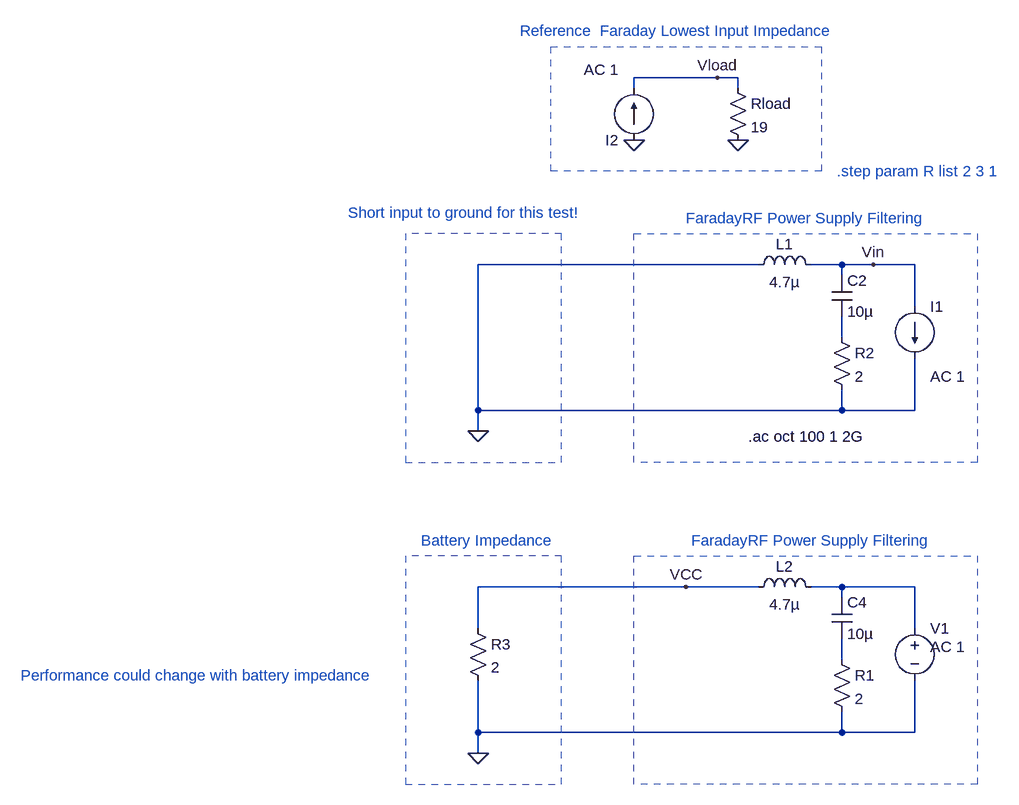
[diagram p0: schematic USBFiltering.asc]
USBFiltering.asc, the LTspice schematic file:
Version 4
SHEET 1 880 996
WIRE -32 -96 -160 -96
WIRE 0 -96 -32 -96
WIRE -160 -80 -160 -96
WIRE 0 -80 0 -96
WIRE 32 192 -400 192
WIRE 160 192 112 192
WIRE 208 192 160 192
WIRE 272 192 208 192
WIRE 160 208 160 192
WIRE 272 256 272 192
WIRE 160 304 160 272
WIRE -400 416 -400 192
WIRE 160 416 160 384
WIRE 160 416 -400 416
WIRE 272 416 272 336
WIRE 272 416 160 416
WIRE -400 448 -400 416
WIRE -80 688 -400 688
WIRE 32 688 -80 688
WIRE 160 688 112 688
WIRE 272 688 160 688
WIRE 160 704 160 688
WIRE -400 752 -400 688
WIRE 272 752 272 688
WIRE 160 800 160 768
WIRE -400 912 -400 832
WIRE 160 912 160 880
WIRE 160 912 -400 912
WIRE 272 912 272 832
WIRE 272 912 160 912
WIRE -400 944 -400 912
FLAG -400 448 0
FLAG -160 0 0
FLAG 0 0 0
FLAG -400 944 0
FLAG 208 192 Vin
FLAG -32 -96 Vload
FLAG -80 688 VCC
SYMBOL cap 144 208 R0
SYMATTR InstName C2
SYMATTR Value 10µ
SYMATTR SpiceLine Rser=10m
SYMBOL ind 16 208 R270
WINDOW 0 32 56 VTop 2
WINDOW 3 5 56 VBottom 2
SYMATTR InstName L1
SYMATTR Value 4.7µ
SYMATTR SpiceLine Ipk=1.9 Rser=0.1075 Rpar=442.74 Cpar=0 mfg="Coilcraft" pn="LPS4018-472"
SYMBOL res 144 288 R0
SYMATTR InstName R2
SYMATTR Value 2
SYMBOL res -16 -96 R0
SYMATTR InstName Rload
SYMATTR Value 19
SYMBOL cap 144 704 R0
SYMATTR InstName C4
SYMATTR Value 10µ
SYMATTR SpiceLine Rser=10m
SYMBOL ind 16 704 R270
WINDOW 0 32 56 VTop 2
WINDOW 3 5 56 VBottom 2
SYMATTR InstName L2
SYMATTR Value 4.7µ
SYMATTR SpiceLine Ipk=1.9 Rser=0.1075 Rpar=442.74 Cpar=0 mfg="Coilcraft" pn="LPS4018-472"
SYMBOL res 144 784 R0
SYMATTR InstName R1
SYMATTR Value 2
SYMBOL current 272 256 R0
WINDOW 123 24 108 Left 2
WINDOW 39 0 0 Left 2
SYMATTR InstName I1
SYMATTR Value ""
SYMATTR Value2 AC 1
SYMBOL current -160 0 R180
WINDOW 123 24 108 Left 2
WINDOW 39 0 0 Left 2
SYMATTR InstName I2
SYMATTR Value ""
SYMATTR Value2 AC 1
SYMBOL voltage 272 736 R0
WINDOW 123 24 44 Left 2
WINDOW 39 0 0 Left 2
SYMATTR InstName V1
SYMATTR Value ""
SYMATTR Value2 AC 1
SYMBOL res -416 736 R0
SYMATTR InstName R3
SYMATTR Value 2
TEXT 16 456 Left 2 !.ac oct 100 1 2G
TEXT -600 112 Left 2 ;Short input to ground for this test!
TEXT -80 120 Left 2 ;FaradayRF Power Supply Filtering
TEXT 152 48 Left 2 ;.step param R list 2 3 1
TEXT -488 616 Left 2 ;Battery Impedance
TEXT -72 616 Left 2 ;FaradayRF Power Supply Filtering
TEXT -1104 824 Left 2 ;Performance could change with battery impedance
TEXT -336 -168 Left 2 ;Reference  Faraday Lowest Input Impedance
RECTANGLE Normal 368 496 -160 144 2
RECTANGLE Normal -512 496 -272 144 2
RECTANGLE Normal 368 992 -160 640 2
RECTANGLE Normal -512 992 -272 640 2
RECTANGLE Normal 128 48 -288 -144 2

The netlist it stands for:
* USBFiltering.asc
C2 Vin N001 10µ Rser=10m
L1 0 Vin 4.7µ Ipk=1.9 Rser=0.1075 Rpar=442.74 Cpar=0 mfg="Coilcraft" pn="LPS4018-472"
R2 N001 0 2
Rload Vload 0 19
C4 N002 N003 10µ Rser=10m
L2 VCC N002 4.7µ Ipk=1.9 Rser=0.1075 Rpar=442.74 Cpar=0 mfg="Coilcraft" pn="LPS4018-472"
R1 N003 0 2
I1 Vin 0 AC 1
I2 0 Vload AC 1
V1 N002 0 AC 1
R3 VCC 0 2
.ac oct 100 1 2G
* Short input to ground for this test!
* FaradayRF Power Supply Filtering
* .step param R list 2 3 1
* Battery Impedance
* FaradayRF Power Supply Filtering
* Performance could change with battery impedance
* Reference  Faraday Lowest Input Impedance
.backanno
.end